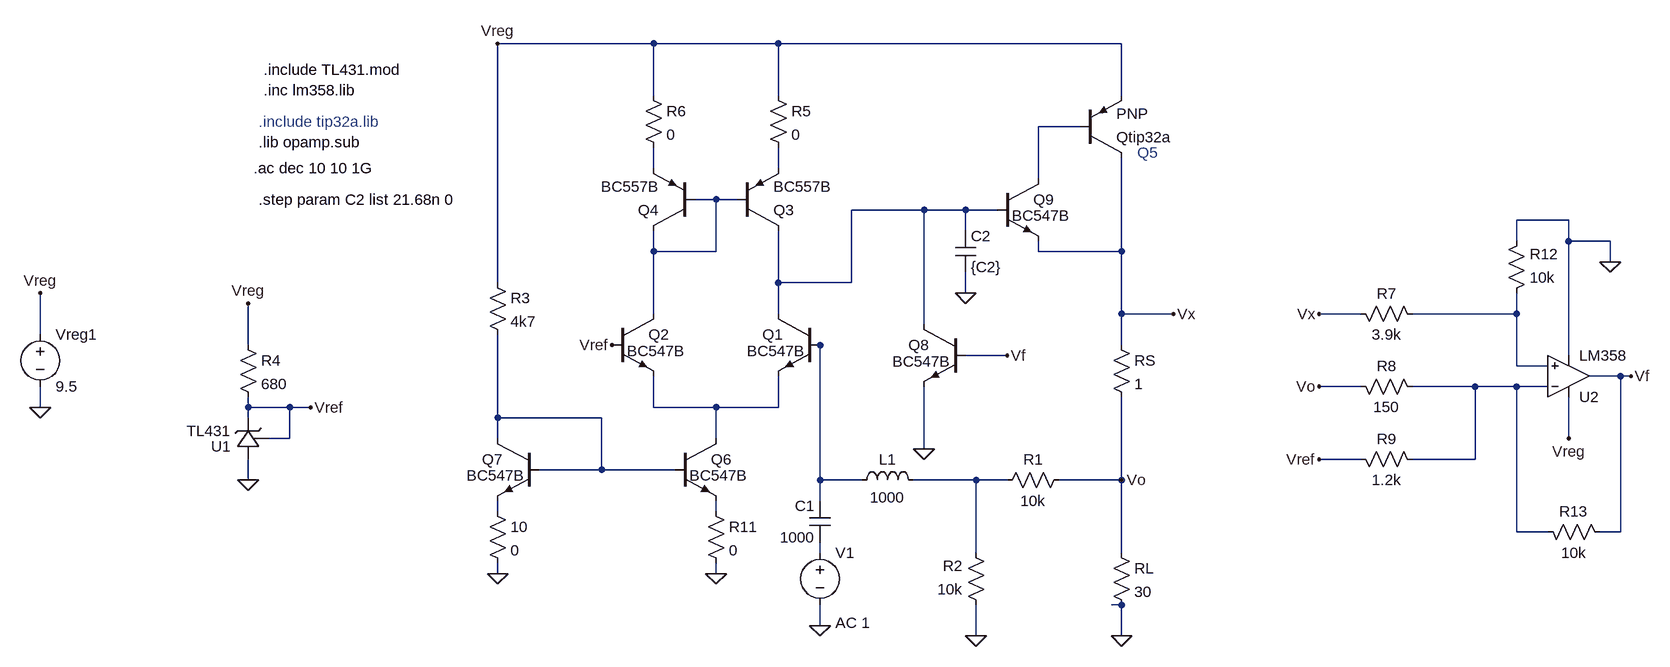
[diagram p0: schematic Lazo de tension.asc]
Lazo de tension.asc, the LTspice schematic file:
Version 4
SHEET 1 1880 680
WIRE 32 -288 -208 -288
WIRE 224 -288 32 -288
WIRE 752 -288 224 -288
WIRE 32 -208 32 -288
WIRE 224 -208 224 -288
WIRE 752 -208 752 -288
WIRE 688 -160 624 -160
WIRE 32 -96 32 -128
WIRE 224 -96 224 -128
WIRE 624 -80 624 -160
WIRE 128 -48 96 -48
WIRE 160 -48 128 -48
WIRE 448 -32 336 -32
WIRE 512 -32 448 -32
WIRE 560 -32 512 -32
WIRE 1440 -16 1360 -16
WIRE 512 0 512 -32
WIRE 1360 16 1360 -16
WIRE 1440 16 1440 -16
WIRE 1504 16 1440 16
WIRE 32 32 32 0
WIRE 128 32 128 -48
WIRE 128 32 32 32
WIRE 624 32 624 16
WIRE 752 32 752 -112
WIRE 752 32 624 32
WIRE 1504 48 1504 16
WIRE -208 80 -208 -288
WIRE 224 80 224 0
WIRE 336 80 336 -32
WIRE 336 80 224 80
WIRE 512 96 512 64
WIRE 32 128 32 32
WIRE 224 128 224 80
WIRE 752 128 752 32
WIRE 832 128 752 128
WIRE 1120 128 1056 128
WIRE 1360 128 1360 96
WIRE 1360 128 1200 128
WIRE 448 144 448 -32
WIRE -912 160 -912 96
WIRE -592 176 -592 112
WIRE 288 176 272 176
WIRE 752 176 752 128
WIRE 576 192 512 192
WIRE 1440 192 1440 16
WIRE 1360 208 1360 128
WIRE 1408 208 1360 208
WIRE 1520 224 1472 224
WIRE 1536 224 1520 224
WIRE 1120 240 1056 240
WIRE 1296 240 1200 240
WIRE 1360 240 1296 240
WIRE 1408 240 1360 240
WIRE -912 272 -912 240
WIRE -592 272 -592 256
WIRE -528 272 -592 272
WIRE -496 272 -528 272
WIRE 32 272 32 224
WIRE 128 272 32 272
WIRE 224 272 224 224
WIRE 224 272 128 272
WIRE -592 288 -592 272
WIRE -208 288 -208 160
WIRE -48 288 -208 288
WIRE -528 320 -528 272
WIRE -528 320 -560 320
WIRE -208 320 -208 288
WIRE 128 320 128 272
WIRE 1440 320 1440 256
WIRE 448 336 448 240
WIRE 1120 352 1056 352
WIRE 1296 352 1296 240
WIRE 1296 352 1200 352
WIRE -48 368 -48 288
WIRE -48 368 -144 368
WIRE 64 368 -48 368
WIRE -592 384 -592 352
WIRE 288 384 288 176
WIRE 352 384 288 384
WIRE 528 384 432 384
WIRE 576 384 528 384
WIRE 752 384 752 256
WIRE 752 384 656 384
WIRE 288 416 288 384
WIRE -208 432 -208 416
WIRE 128 432 128 416
WIRE 1360 464 1360 240
WIRE 1408 464 1360 464
WIRE 1520 464 1520 224
WIRE 1520 464 1488 464
WIRE 288 496 288 480
WIRE 528 496 528 384
WIRE 752 496 752 384
WIRE -208 528 -208 512
WIRE 128 528 128 512
WIRE 752 576 736 576
WIRE 288 608 288 576
WIRE 528 624 528 576
WIRE 752 624 752 576
FLAG 128 528 0
FLAG -208 528 0
FLAG 752 624 0
FLAG 528 624 0
FLAG -32 176 Vref
FLAG -912 272 0
FLAG -912 96 Vreg
FLAG -208 -288 Vreg
FLAG 752 384 Vo
FLAG 832 128 Vx
FLAG 448 336 0
FLAG 576 192 Vf
FLAG 1536 224 Vf
FLAG 1056 352 Vref
FLAG 1056 240 Vo
FLAG 1056 128 Vx
FLAG 1440 320 Vreg
FLAG -592 384 0
FLAG -496 272 Vref
FLAG -592 112 Vreg
FLAG 1504 48 0
FLAG 288 608 0
FLAG 512 96 0
SYMBOL npn -32 128 R0
WINDOW 3 23 57 Left 2
SYMATTR Value BC547B
SYMATTR InstName Q2
SYMBOL pnp 96 0 R180
SYMATTR InstName Q4
SYMATTR Value BC557B
SYMBOL res 672 368 R90
WINDOW 0 0 56 VBottom 2
WINDOW 3 32 56 VTop 2
SYMATTR InstName R1
SYMATTR Value 10k
SYMBOL res 544 592 R180
WINDOW 0 36 76 Left 2
WINDOW 3 36 40 Left 2
SYMATTR InstName R2
SYMATTR Value 10k
SYMBOL res -224 64 R0
SYMATTR InstName R3
SYMATTR Value 4k7
SYMBOL voltage -912 144 R0
WINDOW 123 0 0 Left 0
WINDOW 39 0 0 Left 0
SYMATTR InstName Vreg1
SYMATTR Value 9.5
SYMBOL res 736 480 R0
SYMATTR InstName RL
SYMATTR Value 30
SYMBOL pnp 688 -112 M180
SYMATTR InstName Qtip32a
SYMBOL res 736 160 R0
SYMATTR InstName RS
SYMATTR Value 1
SYMBOL res 1504 480 M270
WINDOW 0 32 56 VTop 2
WINDOW 3 0 56 VBottom 2
SYMATTR InstName R13
SYMATTR Value 10k
SYMBOL res 1216 368 M270
WINDOW 0 32 56 VTop 2
WINDOW 3 0 56 VBottom 2
SYMATTR InstName R9
SYMATTR Value 1.2k
SYMBOL res 1216 256 M270
WINDOW 0 32 56 VTop 2
WINDOW 3 0 56 VBottom 2
SYMATTR InstName R8
SYMATTR Value 150
SYMBOL res 1216 144 M270
WINDOW 0 32 56 VTop 2
WINDOW 3 0 56 VBottom 2
SYMATTR InstName R7
SYMATTR Value 3.9k
SYMBOL res 1344 112 M180
WINDOW 0 36 76 Left 2
WINDOW 3 36 40 Left 2
SYMATTR InstName R12
SYMATTR Value 10k
SYMBOL OpAmps\\opamp2 1440 288 M180
SYMATTR InstName U2
SYMATTR Value LM358
SYMBOL pnp 160 0 M180
SYMATTR InstName Q3
SYMATTR Value BC557B
SYMBOL npn 288 128 M0
WINDOW 3 23 57 Left 2
SYMATTR Value BC547B
SYMATTR InstName Q1
SYMBOL npn 64 320 R0
WINDOW 3 23 57 Left 2
SYMATTR Value BC547B
SYMATTR InstName Q6
SYMBOL npn -144 320 M0
WINDOW 3 23 57 Left 2
SYMATTR Value BC547B
SYMATTR InstName Q7
SYMBOL npn 560 -80 R0
WINDOW 3 23 57 Left 2
SYMATTR Value BC547B
SYMATTR InstName Q9
SYMBOL npn 512 144 M0
WINDOW 3 23 57 Left 2
SYMATTR Value BC547B
SYMATTR InstName Q8
SYMBOL res -608 160 R0
SYMATTR InstName R4
SYMATTR Value 680
SYMBOL TL431 -576 352 R180
SYMATTR InstName U1
SYMBOL res 112 416 R0
SYMATTR InstName R11
SYMATTR Value 0
SYMBOL res -224 416 R0
SYMATTR InstName 10
SYMATTR Value 0
SYMBOL res 16 -224 R0
SYMATTR InstName R6
SYMATTR Value 0
SYMBOL res 208 -224 R0
SYMATTR InstName R5
SYMATTR Value 0
SYMBOL ind 336 400 R270
WINDOW 0 32 56 VTop 2
WINDOW 3 5 56 VBottom 2
SYMATTR InstName L1
SYMATTR Value 1000
SYMBOL cap 304 480 R180
WINDOW 0 24 56 Left 2
WINDOW 3 24 8 Left 2
SYMATTR InstName C1
SYMATTR Value 1000
SYMBOL voltage 288 480 R0
WINDOW 123 24 124 Left 2
WINDOW 39 0 0 Left 0
SYMATTR Value2 AC 1
SYMATTR InstName V1
SYMATTR Value ""
SYMBOL cap 496 0 R0
SYMATTR InstName C2
SYMATTR Value {C2}
TEXT -576 -168 Left 2 ;.include tip32a.lib
TEXT -576 -136 Left 2 !.lib opamp.sub
TEXT -568 -216 Left 2 !.inc lm358.lib
TEXT -568 -248 Left 2 !.include TL431.mod
TEXT 776 -120 Left 2 ;Q5
TEXT -584 -96 Left 2 !.ac dec 10 10 1G
TEXT -576 -48 Left 2 !.step param C2 list 21.68n 0

The netlist it stands for:
* Lazo de tension.asc
Q2 N004 Vref N009 0 BC547B
Q4 N004 N004 N002 0 BC557B
R1 Vo N011 10k
R2 0 N011 10k
R3 Vreg N010 4k7
Vreg1 Vreg 0 9.5
RL Vo 0 30
Qtip32a Vx N001 Vreg 0 PNP
RS Vx Vo 1
R13 Vf N008 10k
R9 N008 Vref 1.2k
R8 N008 Vo 150
R7 N006 Vx 3.9k
R12 N006 0 10k
XU2 N006 N008 Vreg 0 Vf LM358  ; pins In+ In- V+ V- OUT
Q3 N005 N004 N003 0 BC557B
Q1 N005 N007 N009 0 BC547B
Q6 N009 N010 N013 0 BC547B
Q7 N010 N010 N012 0 BC547B
Q9 N001 N005 Vx 0 BC547B
Q8 N005 Vf 0 0 BC547B
R4 Vreg Vref 680
XU1 0 Vref Vref TL431 TL431 TL431  ; pins A K ref
R11 N013 0 0
R§10 N012 0 0
R6 Vreg N002 0
R5 Vreg N003 0
L1 N007 N011 1000
C1 N014 N007 1000
V1 N014 0 AC 1
C2 N005 0 {C2}
.model NPN NPN
.model PNP PNP
.lib standard.bjt
* .include tip32a.lib
.lib opamp.sub
.inc lm358.lib
.include TL431.mod
* Q5
.ac dec 10 10 1G
.step param C2 list 21.68n 0
.lib TL431.mod
.backanno
.end